# EAGLE design Longan Nano SIL Adapter (EAGLE 8.6.3)
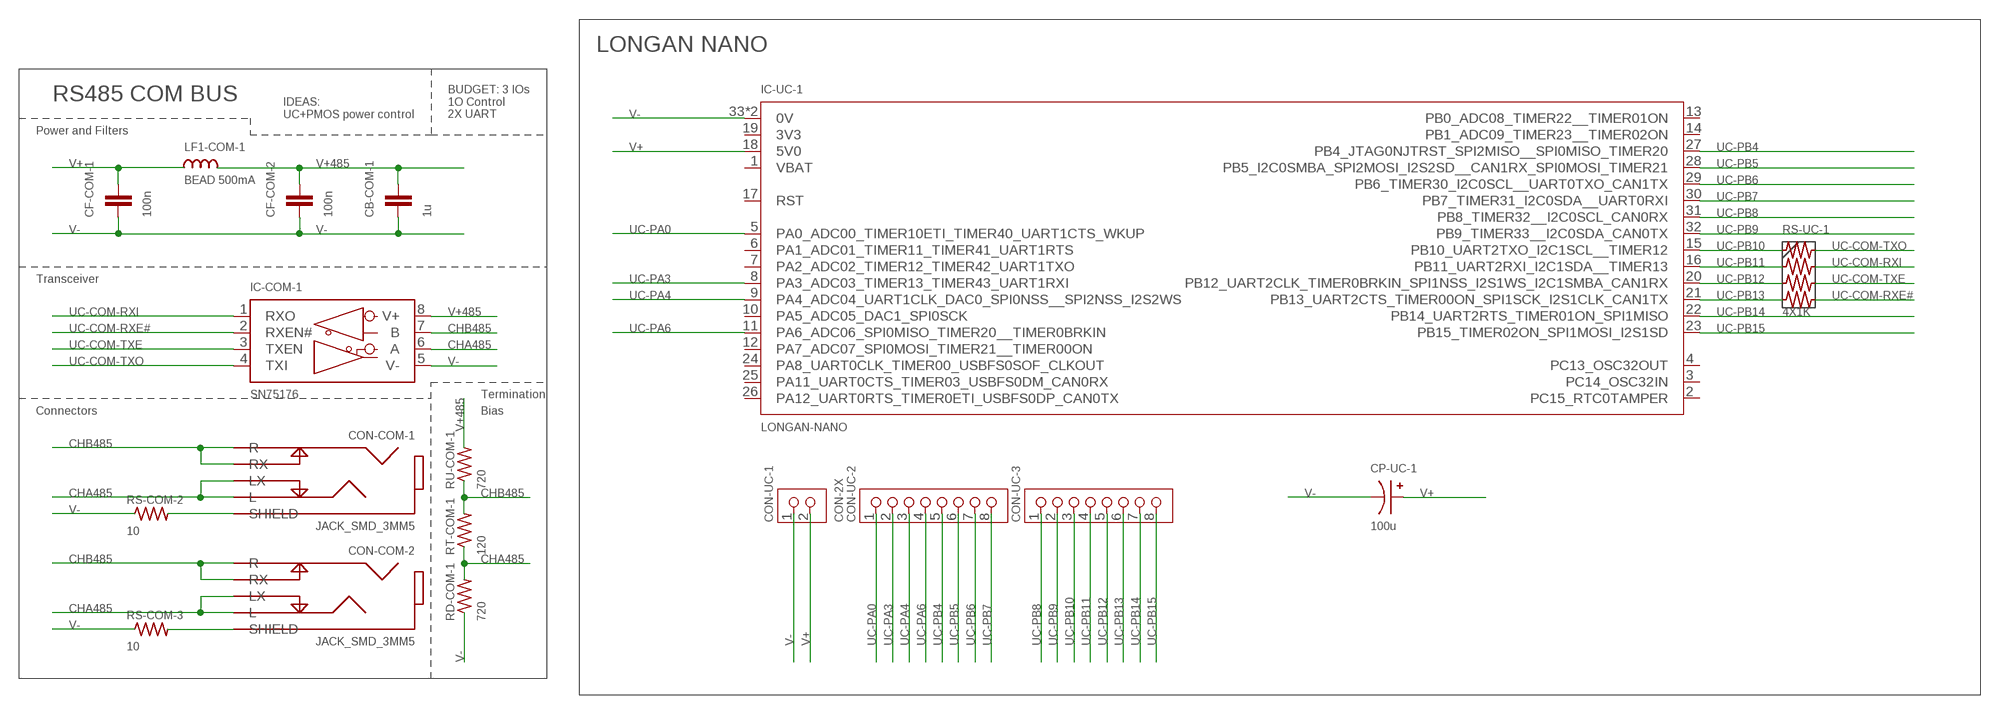
[diagram p0: schematic, sheet 1]

## Parts
CB-COM-1  1u  C-M2012  [SMD-M2012]
CF-COM-1  100n  C-M2012  [SMD-M2012]
CF-COM-2  100n  C-M2012  [SMD-M2012]
CON-COM-1  JACK_SMD_3MM5  [JACK_SMD_3MM5]
CON-COM-2  JACK_SMD_3MM5  [JACK_SMD_3MM5]
CON-UC-1  CON-2X  [TH-2X2.54]
CON-UC-2  CON-8X  [TH-8X2.54]
CON-UC-3  CON-8X  [TH-8X2.54]
CP-UC-1  100u  C+-TH2.54-6.0  [TH-BARREL-2M54-6M0]
IC-COM-1  SN75176  RS485  [DIL08]
IC-UC-1  LONGAN-NANO  [LONGAN-NANO]
LF1-COM-1  BEAD 500mA  L-M2012  [SMD-M2012]
RD-COM-1  720  R-M2012  [SMD-M2012]
RS-COM-2  10  R-M2012  [SMD-M2012]
RS-COM-3  10  R-M2012  [SMD-M2012]
RS-UC-1  4X1K  RX4-M2012-X4  [SMD-M2012-X4]
RT-COM-1  120  R-V2.54-3.0  [TH-LINE-2M54-3M0]
RU-COM-1  720  R-M2012  [SMD-M2012]

## Nets
CHA485: CON-COM-1.L CON-COM-1.LX CON-COM-2.L CON-COM-2.LX IC-COM-1.6(A) RD-COM-1.2 RT-COM-1.P$1
CHB485: CON-COM-1.R CON-COM-1.RX CON-COM-2.R CON-COM-2.RX IC-COM-1.7(B) RT-COM-1.P$2 RU-COM-1.1
N$13 [Supply]: CON-COM-1.SHIELD RS-COM-2.2
N$14 [Supply]: CON-COM-2.SHIELD RS-COM-3.2
UC-COM-RXE#: IC-COM-1.2(RXEN#) RS-UC-1.4B
UC-COM-RXI: IC-COM-1.1(RXO) RS-UC-1.2B
UC-COM-TXE: IC-COM-1.3(TXEN) RS-UC-1.3B
UC-COM-TXO: IC-COM-1.4(TXI) RS-UC-1.1B
UC-PA0: CON-UC-2.1 IC-UC-1.5(PA0_ADC00_TIMER10ETI_TIMER40_UART1CTS_WKUP)
UC-PA3: CON-UC-2.2 IC-UC-1.8(PA3_ADC03_TIMER13_TIMER43_UART1RXI)
UC-PA4: CON-UC-2.3 IC-UC-1.9(PA4_ADC04_UART1CLK_DAC0_SPI0NSS__SPI2NSS_I2S2WS)
UC-PA6: CON-UC-2.4 IC-UC-1.11(PA6_ADC06_SPI0MISO_TIMER20__TIMER0BRKIN)
UC-PB4: CON-UC-2.5 IC-UC-1.27(PB4_JTAG0NJTRST_SPI2MISO__SPI0MISO_TIMER20)
UC-PB5: CON-UC-2.6 IC-UC-1.28(PB5_I2C0SMBA_SPI2MOSI_I2S2SD__CAN1RX_SPI0MOSI_TIMER21)
UC-PB6: CON-UC-2.7 IC-UC-1.29(PB6_TIMER30_I2C0SCL__UART0TXO_CAN1TX)
UC-PB7: CON-UC-2.8 IC-UC-1.30(PB7_TIMER31_I2C0SDA__UART0RXI)
UC-PB8: CON-UC-3.1 IC-UC-1.31(PB8_TIMER32__I2C0SCL_CAN0RX)
UC-PB9: CON-UC-3.2 IC-UC-1.32(PB9_TIMER33__I2C0SDA_CAN0TX)
UC-PB10: CON-UC-3.3 IC-UC-1.15(PB10_UART2TXO_I2C1SCL__TIMER12) RS-UC-1.1A
UC-PB11: CON-UC-3.4 IC-UC-1.16(PB11_UART2RXI_I2C1SDA__TIMER13) RS-UC-1.2A
UC-PB12: CON-UC-3.5 IC-UC-1.20(PB12_UART2CLK_TIMER0BRKIN_SPI1NSS_I2S1WS_I2C1SMBA_CAN1RX) RS-UC-1.3A
UC-PB13: CON-UC-3.6 IC-UC-1.21(PB13_UART2CTS_TIMER00ON_SPI1SCK_I2S1CLK_CAN1TX) RS-UC-1.4A
UC-PB14: CON-UC-3.7 IC-UC-1.22(PB14_UART2RTS_TIMER01ON_SPI1MISO)
UC-PB15: CON-UC-3.8 IC-UC-1.23(PB15_TIMER02ON_SPI1MOSI_I2S1SD)
V+ [Supply]: CF-COM-1.2 CON-UC-1.2 CP-UC-1.+ IC-UC-1.18(5V0) LF1-COM-1.1
V+485 [Supply]: CB-COM-1.2 CF-COM-2.2 IC-COM-1.8(V+) LF1-COM-1.2 RU-COM-1.2
V- [Supply]: CB-COM-1.1 CF-COM-1.1 CF-COM-2.1 CON-UC-1.1 CP-UC-1.- IC-COM-1.5(V-) IC-UC-1.33(0V) IC-UC-1.34(0V) RD-COM-1.1 RS-COM-2.1 RS-COM-3.1
Unconnected: IC-UC-1.2(PC15_RTC0TAMPER) IC-UC-1.3(PC14_OSC32IN) IC-UC-1.4(PC13_OSC32OUT) IC-UC-1.6(PA1_ADC01_TIMER11_TIMER41_UART1RTS) IC-UC-1.7(PA2_ADC02_TIMER12_TIMER42_UART1TXO) IC-UC-1.10(PA5_ADC05_DAC1_SPI0SCK) IC-UC-1.12(PA7_ADC07_SPI0MOSI_TIMER21__TIMER00ON) IC-UC-1.13(PB0_ADC08_TIMER22__TIMER01ON) IC-UC-1.14(PB1_ADC09_TIMER23__TIMER02ON) IC-UC-1.17(RST) IC-UC-1.24(PA8_UART0CLK_TIMER00_USBFS0SOF_CLKOUT) IC-UC-1.25(PA11_UART0CTS_TIMER03_USBFS0DM_CAN0RX) IC-UC-1.26(PA12_UART0RTS_TIMER0ETI_USBFS0DP_CAN0TX)

## Notes on the sheet
- LONGAN NANO
- RS485 COM BUS
- IDEAS:
  UC+PMOS power control
- BUDGET: 3 IOs
  1O Control
  2X UART
- Power and Filters
- Transceiver
- Termination
- Connectors | Bias

## Power pins joined to a net without a drawn wire
3V3: IC-UC-1.19(3V3)
VBAT: IC-UC-1.1(VBAT)

## Library data of the parts
CB-COM-1 CF-COM-1 CF-COM-2 = Passives:C: Capacitor Standard Capacitor (non polarized)
CON-COM-1 CON-COM-2 = Library:JACK_SMD_3MM5: Jack 3.5mm Used to transmit two data channels and 0V reference
CON-UC-1 = Library:CON-2X: Generic connector two pins
CON-UC-2 CON-UC-3 = Library:CON-8X: PIN HEADER
CP-UC-1 = Passives:C+: Polarized Capacitor
IC-COM-1 = 2021-07-02 OrangeHat Library:RS485: RS485 TRANSEIVER; MPN: MAX481CPA+; OC_FARNELL: unknown; OC_NEWARK: 99K3445
IC-UC-1 = Library:LONGAN-NANO: Longan Nano MCU:GD32VF103CBT6
LF1-COM-1 = Passives:L: Inductor
RD-COM-1 RS-COM-2 RS-COM-3 RT-COM-1 RU-COM-1 = Passives:R: Resistor Standard Resistor
RS-UC-1 = Passives:RX4: Four Resistor

## Net classes
0 Signal: width 0.2 mm, drill 0.35 mm, clearance 0.2 mm
1 Supply: width 0.3 mm, drill 0.35 mm, clearance 0.2 mm

## Board
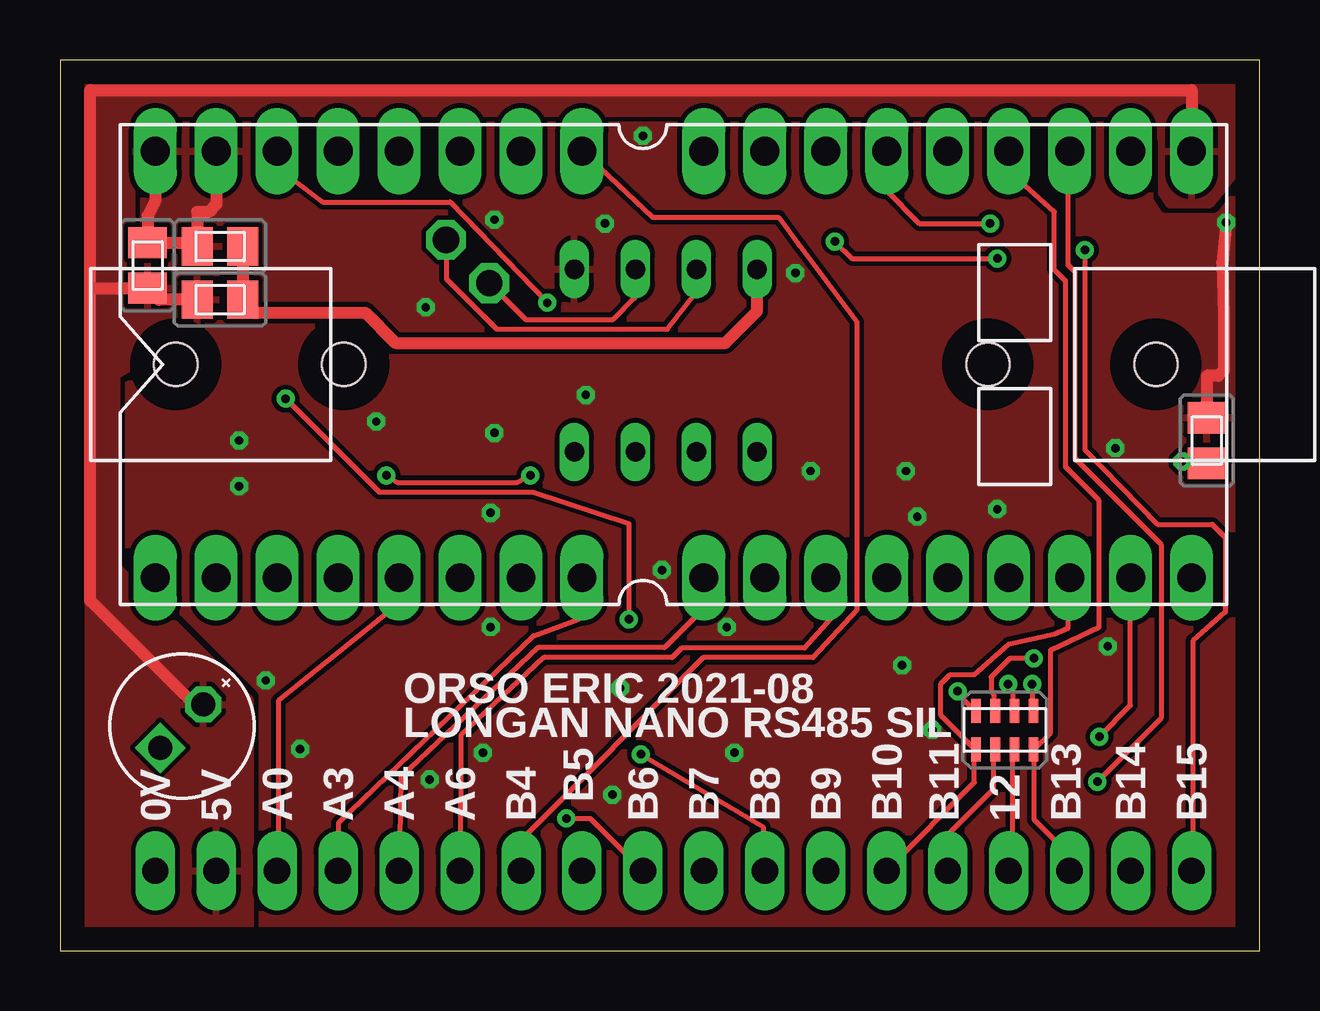
[diagram p1: board, top side]
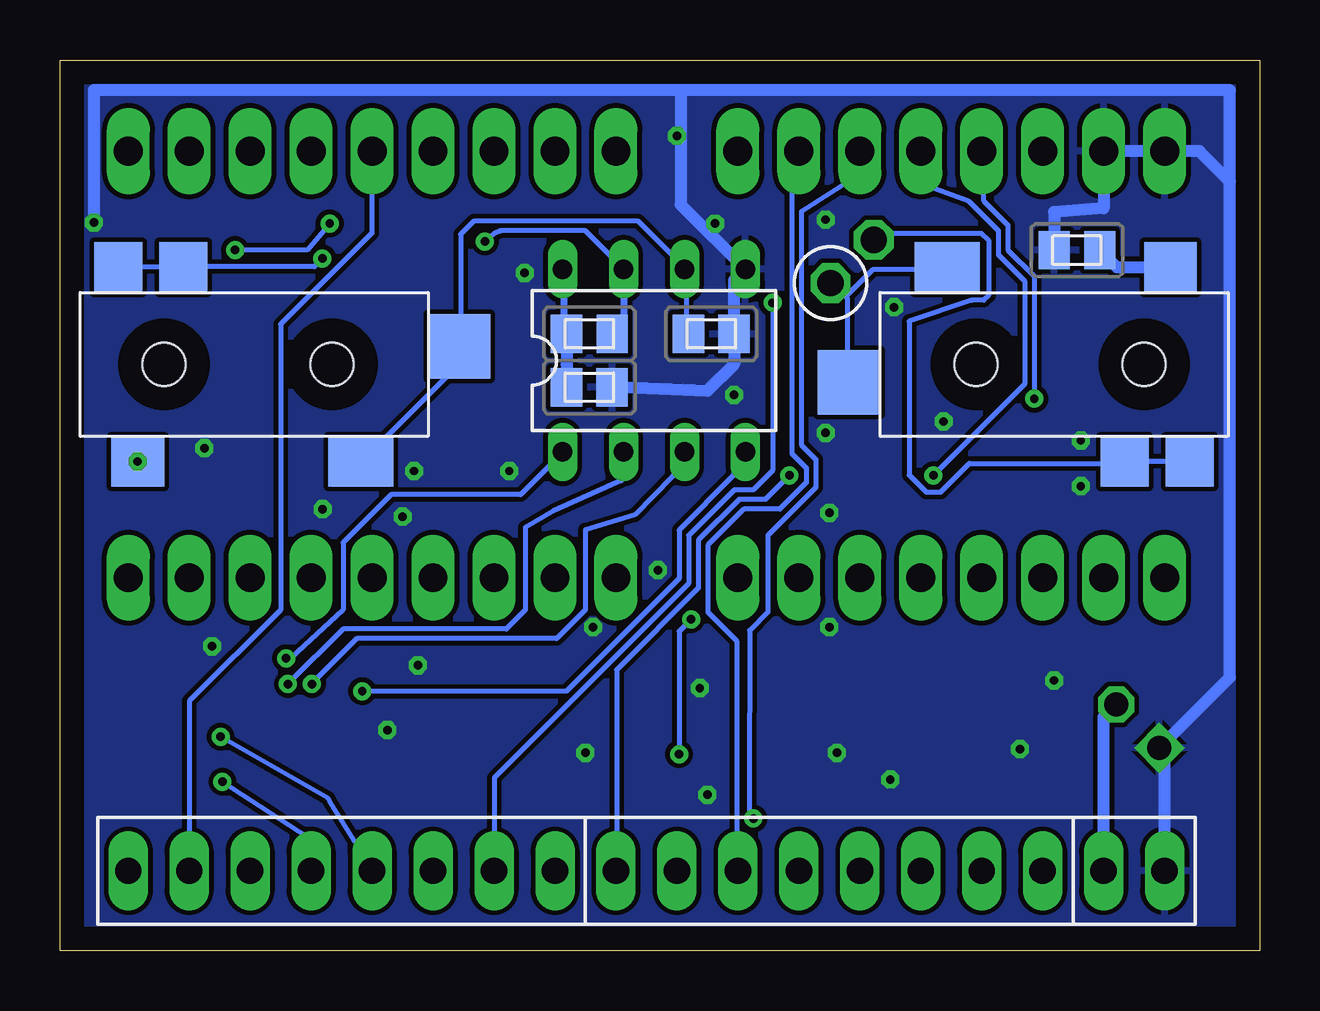
[diagram p2: board, bottom side, seen from below]

Size 49.99 x 37.14 mm. Coordinates in mm from the lower left corner, seen from the top.
Outline: 0,0 49.99,0 49.99,37.14 0,37.14 0,0
Copper layers (1*16): Top 0.035mm / dielectric 1.5mm / Bottom 0.035mm
Design rules "default *": minimum track width 0.00444375mm, minimum drill 0.35mm, track to track 0.2mm, track to pad 0.2mm, pad to pad 0.2mm, via to via 0.2mm, smd to smd 0mil, copper to edge 1mm, drill to drill 0.2mm, minimum pad ring 0.2mm, minimum via ring 0.2mm, stop-mask expansion 0.1mm, vias tented up to drill 0.5mm, thermal gap 0.2mm

### Footprints (pad centres in the part's own frame; a part is rotated, then mirrored left to right if it is on the bottom)
SMD-M2012 = smd 1.3 x 1.6: 1 -0.95,0; 2 0.95,0
JACK_SMD_3MM5 = smd 2.7 x 2.1: L 4.45,-4.05 | smd 2.6 x 2.7: LX 8.55,0.75 | smd 2 x 2.1: R -2.95,4.05; RX -5.65,4.05 | smd 2.2 x 2.1: SHIELD -4.85,-4.05 | hole 1.8: -3.75,0; 3.25,0
TH-2X2.54 = drill 1.1 long: 1 1.27,0; 2 3.81,0
TH-8X2.54 = drill 1.1 long: 1 1.27,0; 2 3.81,0; 3 6.35,0; 4 8.89,0; 5 11.43,0; 6 13.97,0; 7 16.51,0; 8 19.05,0
TH-BARREL-2M54-6M0 = drill 1 octagon: + -1.27,0 | drill 1 square: - 1.27,0
DIL08 = drill 0.813 long: 1 -3.81,-3.81; 2 -1.27,-3.81; 3 1.27,-3.81; 4 3.81,-3.81; 5 3.81,3.81; 6 1.27,3.81; 7 -1.27,3.81; 8 -3.81,3.81
LONGAN-NANO = drill 1.2 long: 1 -20.32,-8.89; 2 -17.78,-8.89; 3 -15.24,-8.89; 4 -12.7,-8.89; 5 -10.16,-8.89; 6 -7.62,-8.89; 7 -5.08,-8.89; 8 -2.54,-8.89; 9 2.54,-8.89; 10 5.08,-8.89; 11 7.62,-8.89; 12 10.16,-8.89; 13 12.7,-8.89; 14 15.24,-8.89; 15 17.78,-8.89; 16 20.32,-8.89; 17 22.86,-8.89; 18 22.86,8.89; 19 20.32,8.89; 20 17.78,8.89; 21 15.24,8.89; 22 12.7,8.89; 23 10.16,8.89; 24 7.62,8.89; 25 5.08,8.89; 26 2.54,8.89; 27 -2.54,8.89; 28 -5.08,8.89; 29 -7.62,8.89; 30 -10.16,8.89; 31 -12.7,8.89; 32 -15.24,8.89; 33 -17.78,8.89; 34 -20.32,8.89
SMD-M2012-X4 = smd 0.4 x 1: 1A -1.2,-0.8; 1B -1.2,0.8; 2A -0.4,-0.8; 2B -0.4,0.8; 3A 0.4,-0.8; 3B 0.4,0.8; 4A 1.2,-0.8; 4B 1.2,0.8
TH-LINE-2M54-3M0 = drill 1.1 octagon: P$1 -1.27,0; P$2 1.27,0

### Placement (x,y rotation side)
CB-COM-1  27.94,23.5 180 bottom
CF-COM-1  3.65,28.57 270 top
CF-COM-2  6.67,29.37 0 top
CON-COM-1  8.57,24.45 180 bottom
CON-COM-2  41.91,24.45 0 bottom
CON-UC-1  2.7,3.33 180 bottom
CON-UC-2  7.78,3.33 180 bottom
CON-UC-3  28.1,3.33 180 bottom
CP-UC-1  5.08,9.37 225 top
IC-COM-1  25.24,24.61 0 bottom
IC-UC-1  24.29,24.45 0 top
LF1-COM-1  6.67,27.15 0 top
RD-COM-1  22.86,25.72 180 bottom
RS-COM-2  7.62,29.21 0 bottom
RS-COM-3  47.78,21.27 270 top
RS-UC-1  39.37,9.21 0 top
RT-COM-1  16.99,28.73 45 bottom
RU-COM-1  27.94,25.72 180 bottom
U$1  [SIGNATURE_ADROBOT_SMALL]  12.06,8.89 0 top
U$2  [SIGNATURE_ORANGEBOT_SMALL]  10.79,10.16 0 top

### Tracks (layer width: path | path; a pad name or v marks a point on that pad's centre or on a via)
CHA485
  Top 0.2: IC-COM-1.6 23.9,28.32 23.93,27.21 23.05,26.32 19.4,26.32 17.9,27.82 17.66,28.06
  Bottom 0.2: CON-COM-2.L 37.4,20.42 33.4,24.42 33.4,25.12 CON-COM-2.LX 33.3,25.22 33.3,29.88 32.76,30.42 25.9,30.42 24,28.52 IC-COM-1.6 23.9,28.32 23.9,25.72 RD-COM-1.2 | 17.25,27.27 17.8,27.82 RT-COM-1.P$1 | 17.25,27.27 17.2,27.22 17.2,23.72 CON-COM-1.LX | 17.25,27.27 16.1,28.42 13.1,28.42 CON-COM-1.L
CHB485  (via drill 0.35)
  Top 0.2: v39.06,28.86 33.01,28.86 v32.29,29.57 | IC-COM-1.7 26.5,28.32 26.43,27.36 25.3,25.92 18.2,25.92 16.1,28.02 16.1,29.62 16.31,29.41
  Bottom 0.2: CON-COM-2.RX 47.5,28.52 44.9,28.52 CON-COM-2.R 44.8,28.52 39.4,28.52 v39.06,28.86 | v32.29,29.57 32.22,29.64 31.91,29.89 31.62,30.02 28.1,30.02 26.6,28.52 IC-COM-1.7 | CON-COM-1.RX 3,20.42 5.6,20.42 CON-COM-1.R 5.7,20.32 12.1,20.32 13.3,19.12 13.9,19.12 14.62,19.84 14.62,26.25 12,27.12 11.5,27.12 11.3,27.32 11.3,29.62 11.6,29.92 15.8,29.92 16,29.72 RT-COM-1.P$2
  Bottom 0.3: IC-COM-1.7 26.51,26.04 RU-COM-1.1
N$13
  Bottom 0.5: RS-COM-2.2 5.96,28.5 CON-COM-1.SHIELD
N$14  (via drill 0.35)
  Top 0.5: RS-COM-3.2 46.68,20.32 | 46.67,20.32 46.68,20.32 | 46.68,20.32 CON-COM-2.SHIELD
  Bottom 0.3: CON-COM-2.SHIELD
  other vias: 46.76,20.4
UC-COM-RXE#  (via drill 0.35)
  Top 0.2: v40.5,11.12 40.5,10.02 RS-UC-1.4B
  Bottom 0.2: v40.5,11.12 38.2,13.42 31.4,13.42 30.6,14.22 30.6,17.65 29.44,18.34 26.6,19.61 IC-COM-1.2
UC-COM-RXI  (via drill 0.35)
  Top 0.2: v40.58,12.2 39.58,12.2 38.8,11.42 38.8,10.82 38.9,10.72 38.9,10.02 RS-UC-1.2B
  Bottom 0.2: v40.58,12.2 40.38,12.2 38.2,14.22 38.2,17.02 36.2,19.02 30.8,19.02 29.1,20.72 IC-COM-1.1
UC-COM-TXE  (via drill 0.35)
  Top 0.2: v39.5,11.12 39.7,10.92 39.7,10.02 RS-UC-1.3B
  Bottom 0.2: v39.5,11.12 39.53,11.12 37.63,13.02 29.3,13.02 28.1,14.22 28.1,17.55 26.05,18.18 24.48,19.77 IC-COM-1.3
UC-COM-TXO  (via drill 0.35)
  Top 0.2: v37.4,10.82 37.4,10.72 38.1,10.02 RS-UC-1.1B
  Bottom 0.2: v37.4,10.82 28.9,10.82 24.2,15.52 24.2,17.54 21.98,19.77 IC-COM-1.4
UC-PA0
  Top 0.2: CON-UC-2.1 9.1,3.42 9.1,10.42 14.04,14.41 IC-UC-1.5
UC-PA3
  Top 0.2: CON-UC-2.2 11.6,3.42 11.6,5.32 19.74,13.14 21.59,13.81 21.59,15.4 IC-UC-1.8
UC-PA4
  Top 0.2: CON-UC-2.3 14.2,7.23 19.93,12.64 25.19,12.64 26.8,14.25 IC-UC-1.9
UC-PA6
  Top 0.2: CON-UC-2.4 16.7,8.97 20.16,12.22 25.51,12.22 25.91,12.62 31.01,12.62 32.32,14.09 IC-UC-1.11
UC-PB4
  Top 0.2: CON-UC-2.5 19.3,3.42 19.3,4.72 26.81,12.22 31.36,12.22 33.2,14.22 33.2,26.23 30.79,29.43 30.79,29.42 29.95,30.58 24.69,30.58 21.8,33.32 IC-UC-1.27
UC-PB5
  Bottom 0.2: CON-UC-2.6 21.8,3.42 21.8,12.92 23,14.12 23,16.92 21.5,18.42 20,18.42 18.9,19.52 18.9,20.13 19.5,20.73 19.5,33.12 19.3,33.32 IC-UC-1.28
UC-PB6  (via drill 0.35)
  Top 0.2: v21.1,5.52 22.1,5.52 24.2,3.42 CON-UC-2.7
  Bottom 0.2: v21.1,5.52 21.27,5.69 21.27,6.51 21.26,13.36 20.5,14.12 20.5,17.32 18.5,19.32 18.5,20.49 19.1,21.09 19.1,30.82 16.92,32.21 IC-UC-1.29
UC-PB7  (via drill 0.35)
  Top 0.2: v13.6,19.82 14.05,19.53 19.05,19.53 v19.6,19.82
  Bottom 0.2: v19.6,19.82 20.6,18.82 21.7,18.82 23.4,17.12 23.4,15.12 26.8,11.72 26.8,3.42 CON-UC-2.8 | v13.6,19.82 9.8,23.62 9.8,27.92 10.9,29.02 10.9,30.02 12.14,31.25 13.97,31.91 13.97,33.18 IC-UC-1.30
UC-PB8  (via drill 0.35)
  Top 0.2: v24.2,8.2 29.3,5.16 CON-UC-3.1 | v23.7,13.82 23.7,17.8 19.69,19.12 13.3,19.12 v9.4,23.02
  Bottom 0.2: v24.2,8.2 24.2,13.32 v23.7,13.82 | v9.4,23.02 9.4,28.12 10.5,29.22 10.5,30.25 11.5,31.25 IC-UC-1.31
UC-PB9  (via drill 0.35)
  Top 0.2: v20.3,27.02 16.26,31.22 10.94,31.22 9.63,32.21 IC-UC-1.32
  Bottom 0.2: v20.3,27.02 20.3,20.02 21.1,19.22 21.9,19.22 23.8,17.32 23.8,15.32 31.9,7.22 31.9,3.42 CON-UC-3.2
UC-PB10
  Top 0.2: CON-UC-3.3 34.5,3.42 38.1,7.02 38.1,8.32 RS-UC-1.1A 38.1,8.42 36.7,9.82 36.7,11.12 37.1,11.52 38.1,11.52 39.53,12.79 41.44,13.21 42,13.45 IC-UC-1.15
UC-PB11  (via drill 0.35)
  Top 0.2: RS-UC-1.2A 38.9,8.32 38.9,6.75 37,4.85 CON-UC-3.4 | v43.3,8.93 44.6,10.22 44.6,15.52 IC-UC-1.16
  Bottom 0.2: v43.3,8.93 38.82,6.35 38.73,6.19 37,3.42 CON-UC-3.4
UC-PB12  (via drill 0.35)
  Top 0.2: RS-UC-1.3A 39.7,8.32 39.7,3.52 39.6,3.42 CON-UC-3.5 | v43.23,7.05 45.9,9.72 45.9,16.92 42.3,20.52 42.3,28.29 42,28.59 42,33.32 IC-UC-1.20
  Bottom 0.2: v43.23,7.05 39.6,4.69 CON-UC-3.5
UC-PB13
  Top 0.2: CON-UC-3.6 42,4.05 40.6,5.45 40.6,8.32 RS-UC-1.4A 40.6,8.42 41.27,9.09 41.27,12.54 43.3,13.5 43.3,18.76 41.9,20.16 41.9,27.93 41.43,28.39 41.43,30.8 39.6,32.45 39.6,33.32 IC-UC-1.21
UC-PB14
  Bottom 0.2: CON-UC-3.7 44.6,3.42 44.6,10.42 40.8,14.22 40.8,26.12 37,29.92 37,33.32 IC-UC-1.22
UC-PB15  (via drill 0.35)
  Top 0.2: v42.7,29.22 42.7,20.88 45.72,17.78 48.02,17.78 48.56,17.24 48.56,14.12 47.2,12.92 47.2,3.42 CON-UC-3.8 | v38.75,30.32 35.81,30.32 34.4,31.73 IC-UC-1.23
  Bottom 0.2: v42.7,29.22 39.7,29.22 v38.75,30.32
V+
  Top 0.5: CP-UC-1.+ 5.59,10.26 1.25,14.61 1.25,27.78 | 1.25,27.78 1.25,35.87 1.27,35.89 47.15,35.89 IC-UC-1.18 | 1.25,27.78 1.41,27.62 CF-COM-1.2 4.13,27.15 LF1-COM-1.1
  Bottom 0.5: CON-UC-1.2 6.51,9.73 CP-UC-1.+
  pour Top (isolate 0.2, rank 3): -0.48,-0.95 7.94,-0.95 7.94,10.48 2.38,16.03 2.38,23.97 6.51,26.51 6.51,29.05 3.49,29.05 3.02,30.16 3.02,34.92 45.4,34.92 45.88,33.81 45.88,31.59 46.2,31.11 47.94,31.11 49.21,32.7 49.21,39.05 -0.16,37.94 -0.79,37.31 -0.79,-0.64
V+485
  Top 0.5: CF-COM-2.2 LF1-COM-1.2 8.17,26.6 12.71,26.6 13.97,25.34 27.72,25.34 29.05,26.67 IC-COM-1.8
  Bottom 0.3: 29.05,25.72 RU-COM-1.2 29,25.92 29,28.32 IC-COM-1.8
  Bottom 0.5: RU-COM-1.2 28.89,24.44 CB-COM-1.2
V-  (via drill 0.35)
  Top 0.5: IC-UC-1.33 6.51,31.12 6.19,30.8 5.71,30.8 CF-COM-2.1 5.56,29.52 CF-COM-1.1 3.65,30.64 3.97,31.27 IC-UC-1.34 | v48.59,30.36 48.43,28.68 48.5,26.54 48.5,24.21 48.26,23.97 47.78,23.97 RS-COM-3.1
  Bottom 0.5: CON-UC-1.1 3.97,8.26 CP-UC-1.- 1.25,11.4 1.25,32.07 | 1.25,32.07 2.52,33.34 IC-UC-1.34 IC-UC-1.33 6.51,30.96 8.57,30.8 8.57,29.53 RS-COM-2.1 | 1.25,32.07 1.25,35.87 1.27,35.89 24.12,35.89 24.13,35.88 | 24.13,35.88 24.13,31.11 IC-COM-1.5 21.91,27.94 RD-COM-1.1 21.91,24.45 23.02,23.34 CB-COM-1.1 | 24.13,35.88 48.59,35.88 v48.59,30.36
  other vias: 21.91,23.18 31.27,20 35.08,11.91 7.46,19.37 7.46,21.27 13.18,22.07 24.29,33.97 35.24,20 39.05,18.41 36.35,9.21 28.1,8.26 23.34,10.95 23.02,6.51 15.4,7.14 10,8.41 8.57,11.27 18.1,30.48 22.7,30.32 15.24,26.83 17.94,18.26 18.1,21.59 30.64,28.26 35.72,18.1 25.08,15.88 17.94,13.49 17.62,8.26 27.78,13.49 43.97,20.95 43.66,12.7
  pour Bottom (isolate 0.2, rank 3): -0.16,0.32 -0.16,37.15 0,37.31 50.32,37.31 50.48,37.15 50.48,0.16 50.01,-0.32 0.48,-0.32
  pour Top (isolate 0.2, rank 4): -3.97,38.89 51.75,38.89 51.75,-0.48 -1.43,-0.48 -3.97,2.06

### Text on the board
tNames: ORSO ERIC 2021-08 | LONGAN NANO RS485 SIL | B5 | 0V | 5V | A0 | A3 | A4 | A6 | B4 | B6 | B7 | B8 | B9 | B10 | B11 | 12 | B13 | B14 | B15
bValues: 120 | 0V | 5V | A0 | A3 | A4 | A6 | B4 | B5 | B6 | B7 | B8 | B9 | B10 | B11 | B12 | B13 | B14 | B15